# EAGLE design atmega embedded main (EAGLE 9.5.1)
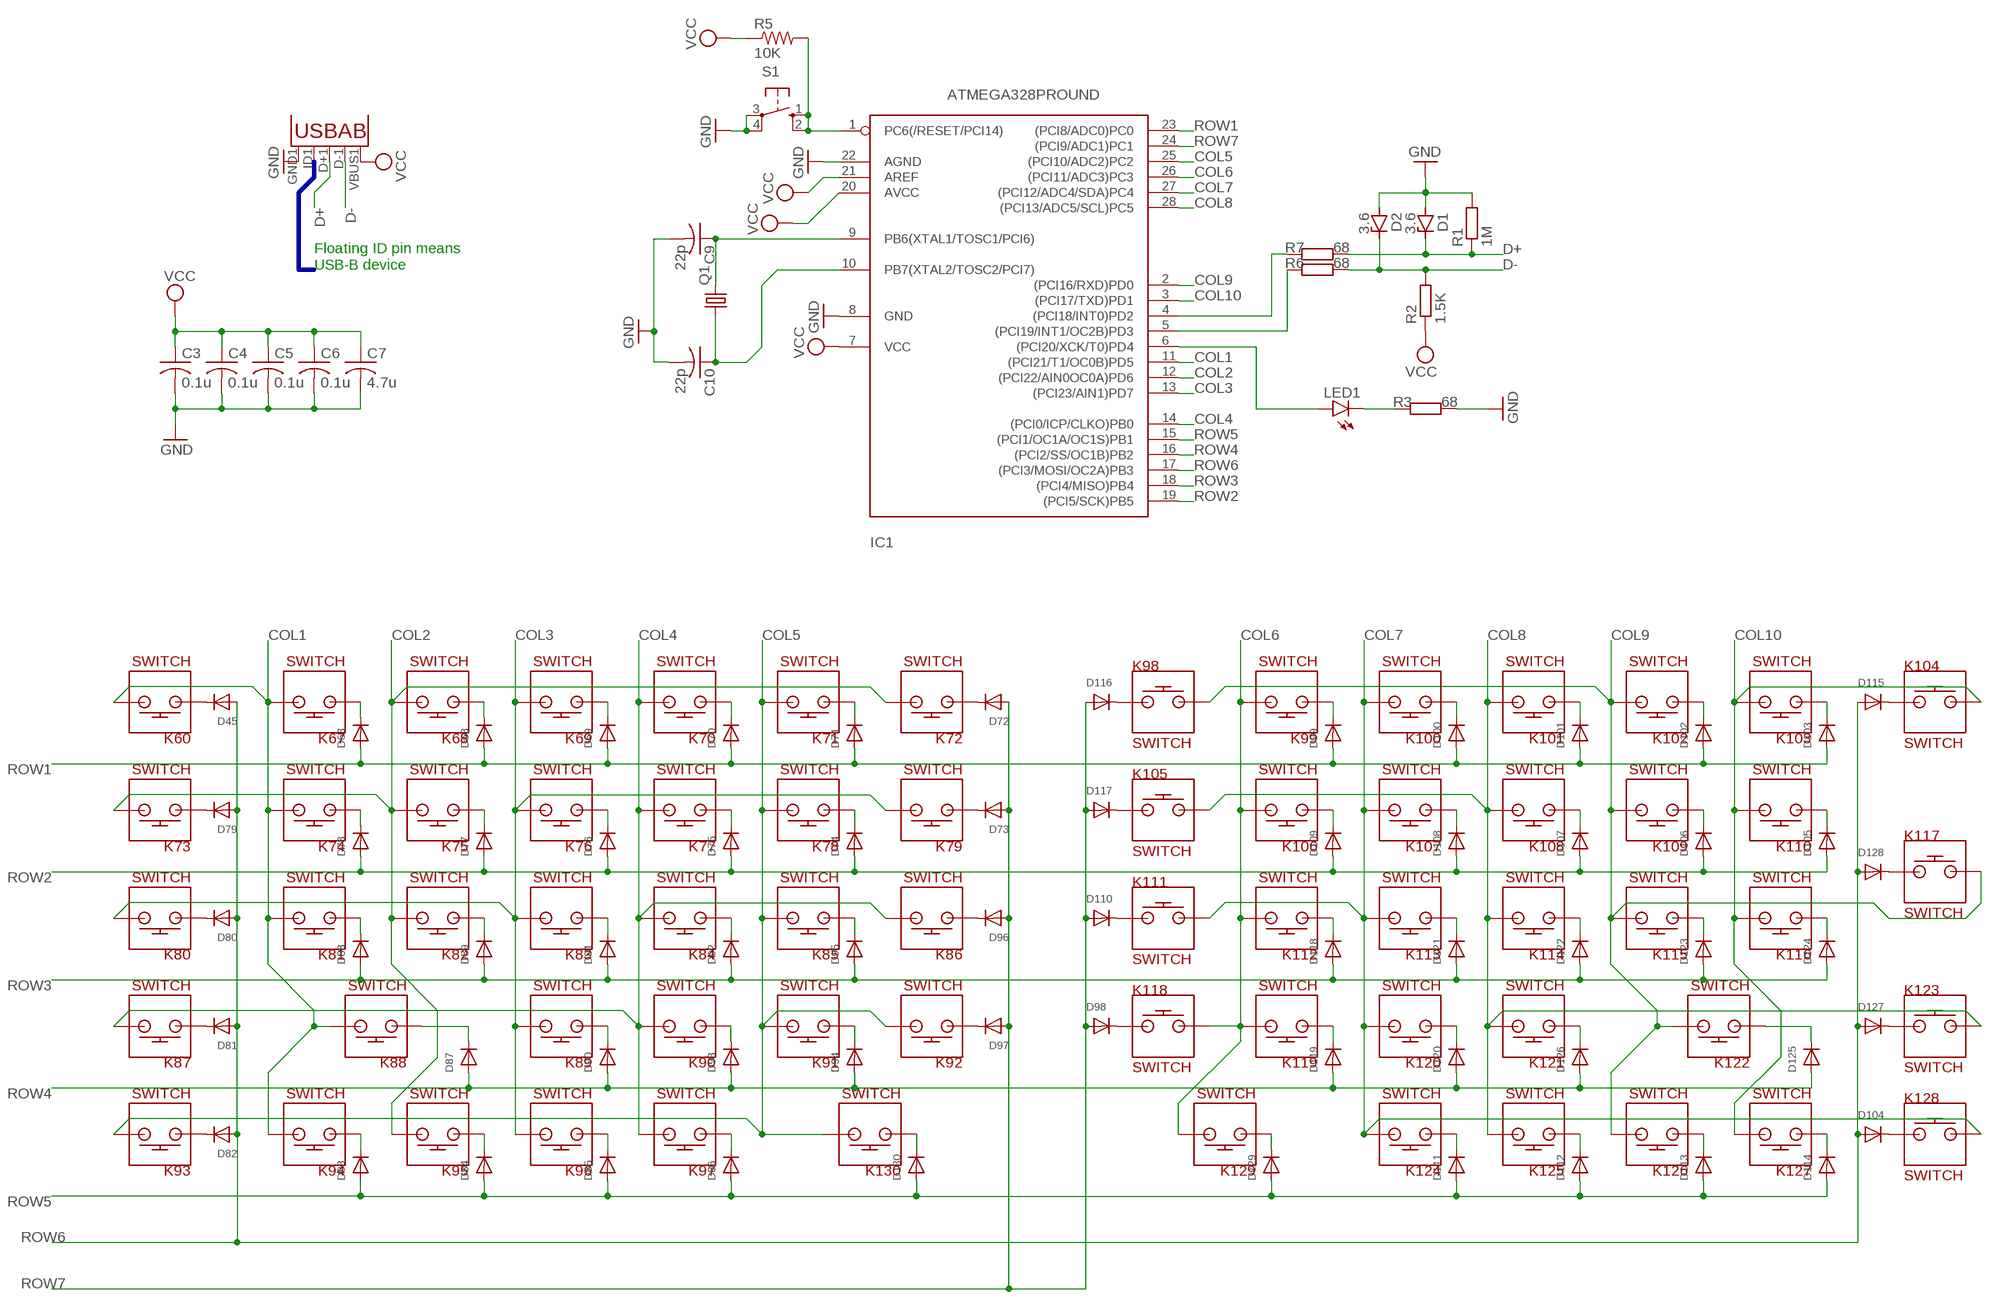
[diagram p0: schematic, sheet 1]

## Parts
C3  0.1u  C-USC0805  [C0805]
C4  0.1u  C-USC0805  [C0805]
C5  0.1u  C-USC0805  [C0805]
C6  0.1u  C-USC0805  [C0805]
C7  4.7u  C-USC0805  [C0805]
C9  22p  C-USC0805  [C0805]
C10  22p  C-USC0805  [C0805]
D1  3.6  ZENER-DIODESMB  [SMB]
D2  3.6  ZENER-DIODESMB  [SMB]
D45  DIODESMA  [SMADIODE]
D63  DIODESMA  [SMADIODE]
D68  DIODESMA  [SMADIODE]
D69  DIODESMA  [SMADIODE]
D70  DIODESMA  [SMADIODE]
D71  DIODESMA  [SMADIODE]
D72  DIODESMA  [SMADIODE]
D73  DIODESMA  [SMADIODE]
D74  DIODESMA  [SMADIODE]
D75  DIODESMA  [SMADIODE]
D76  DIODESMA  [SMADIODE]
D77  DIODESMA  [SMADIODE]
D78  DIODESMA  [SMADIODE]
D79  DIODESMA  [SMADIODE]
D80  DIODESMA  [SMADIODE]
D81  DIODESMA  [SMADIODE]
D82  DIODESMA  [SMADIODE]
D83  DIODESMA  [SMADIODE]
D84  DIODESMA  [SMADIODE]
D85  DIODESMA  [SMADIODE]
D86  DIODESMA  [SMADIODE]
D87  DIODESMA  [SMADIODE]
D88  DIODESMA  [SMADIODE]
D89  DIODESMA  [SMADIODE]
D90  DIODESMA  [SMADIODE]
D91  DIODESMA  [SMADIODE]
D92  DIODESMA  [SMADIODE]
D93  DIODESMA  [SMADIODE]
D94  DIODESMA  [SMADIODE]
D95  DIODESMA  [SMADIODE]
D96  DIODESMA  [SMADIODE]
D97  DIODESMA  [SMADIODE]
D98  DIODESMA  [SMADIODE]
D99  DIODESMA  [SMADIODE]
D100  DIODESMA  [SMADIODE]
D101  DIODESMA  [SMADIODE]
D102  DIODESMA  [SMADIODE]
D103  DIODESMA  [SMADIODE]
D104  DIODESMA  [SMADIODE]
D105  DIODESMA  [SMADIODE]
D106  DIODESMA  [SMADIODE]
D107  DIODESMA  [SMADIODE]
D108  DIODESMA  [SMADIODE]
D109  DIODESMA  [SMADIODE]
D110  DIODESMA  [SMADIODE]
D111  DIODESMA  [SMADIODE]
D112  DIODESMA  [SMADIODE]
D113  DIODESMA  [SMADIODE]
D114  DIODESMA  [SMADIODE]
D115  DIODESMA  [SMADIODE]
D116  DIODESMA  [SMADIODE]
D117  DIODESMA  [SMADIODE]
D118  DIODESMA  [SMADIODE]
D119  DIODESMA  [SMADIODE]
D120  DIODESMA  [SMADIODE]
D121  DIODESMA  [SMADIODE]
D122  DIODESMA  [SMADIODE]
D123  DIODESMA  [SMADIODE]
D124  DIODESMA  [SMADIODE]
D125  DIODESMA  [SMADIODE]
D126  DIODESMA  [SMADIODE]
D127  DIODESMA  [SMADIODE]
D128  DIODESMA  [SMADIODE]
D129  DIODESMA  [SMADIODE]
D130  DIODESMA  [SMADIODE]
IC1  ATMEGA328PROUND  [DIL28-3-ROUND]
K60  SWITCH  [KAILH_LOW_PROFILE]
K67  SWITCH  [KAILH_LOW_PROFILE]
K68  SWITCH  [KAILH_LOW_PROFILE]
K69  SWITCH  [KAILH_LOW_PROFILE]
K70  SWITCH  [KAILH_LOW_PROFILE]
K71  SWITCH  [KAILH_LOW_PROFILE]
K72  SWITCH  [KAILH_LOW_PROFILE]
K73  SWITCH  [KAILH_LOW_PROFILE]
K74  SWITCH  [KAILH_LOW_PROFILE]
K75  SWITCH  [KAILH_LOW_PROFILE]
K76  SWITCH  [KAILH_LOW_PROFILE]
K77  SWITCH  [KAILH_LOW_PROFILE]
K78  SWITCH  [KAILH_LOW_PROFILE]
K79  SWITCH  [KAILH_LOW_PROFILE]
K80  SWITCH  [KAILH_LOW_PROFILE]
K81  SWITCH  [KAILH_LOW_PROFILE]
K82  SWITCH  [KAILH_LOW_PROFILE]
K83  SWITCH  [KAILH_LOW_PROFILE]
K84  SWITCH  [KAILH_LOW_PROFILE]
K85  SWITCH  [KAILH_LOW_PROFILE]
K86  SWITCH  [KAILH_LOW_PROFILE]
K87  SWITCH  [KAILH_LOW_PROFILE]
K88  SWITCH  [KAILH_LOW_PROFILE]
K89  SWITCH  [KAILH_LOW_PROFILE]
K90  SWITCH  [KAILH_LOW_PROFILE]
K91  SWITCH  [KAILH_LOW_PROFILE]
K92  SWITCH  [KAILH_LOW_PROFILE]
K93  SWITCH  [KAILH_LOW_PROFILE]
K94  SWITCH  [KAILH_LOW_PROFILE]
K95  SWITCH  [KAILH_LOW_PROFILE]
K96  SWITCH  [KAILH_LOW_PROFILE]
K97  SWITCH  [KAILH_LOW_PROFILE]
K98  SWITCH  [KAILH_LOW_PROFILE]
K99  SWITCH  [KAILH_LOW_PROFILE]
K100  SWITCH  [KAILH_LOW_PROFILE]
K101  SWITCH  [KAILH_LOW_PROFILE]
K102  SWITCH  [KAILH_LOW_PROFILE]
K103  SWITCH  [KAILH_LOW_PROFILE]
K104  SWITCH  [KAILH_LOW_PROFILE]
K105  SWITCH  [KAILH_LOW_PROFILE]
K106  SWITCH  [KAILH_LOW_PROFILE]
K107  SWITCH  [KAILH_LOW_PROFILE]
K108  SWITCH  [KAILH_LOW_PROFILE]
K109  SWITCH  [KAILH_LOW_PROFILE]
K110  SWITCH  [KAILH_LOW_PROFILE]
K111  SWITCH  [KAILH_LOW_PROFILE]
K112  SWITCH  [KAILH_LOW_PROFILE]
K113  SWITCH  [KAILH_LOW_PROFILE]
K114  SWITCH  [KAILH_LOW_PROFILE]
K115  SWITCH  [KAILH_LOW_PROFILE]
K116  SWITCH  [KAILH_LOW_PROFILE]
K117  SWITCH  [KAILH_LOW_PROFILE]
K118  SWITCH  [KAILH_LOW_PROFILE]
K119  SWITCH  [KAILH_LOW_PROFILE]
K120  SWITCH  [KAILH_LOW_PROFILE]
K121  SWITCH  [KAILH_LOW_PROFILE]
K122  SWITCH  [KAILH_LOW_PROFILE]
K123  SWITCH  [KAILH_LOW_PROFILE]
K124  SWITCH  [KAILH_LOW_PROFILE]
K125  SWITCH  [KAILH_LOW_PROFILE]
K126  SWITCH  [KAILH_LOW_PROFILE]
K127  SWITCH  [KAILH_LOW_PROFILE]
K128  SWITCH  [KAILH_LOW_PROFILE]
K129  SWITCH  [KAILH_LOW_PROFILE]
K130  SWITCH  [KAILH_LOW_PROFILE]
LED1  LEDCHIPLED_1206  [CHIPLED_1206]
Q1  CRYSTALHC49S  [HC49/S]
R1  1M  RR1206  [R1206]
R2  1.5K  RR1206  [R1206]
R3  68  RR1206  [R1206]
R5  10K  R-US_M0805  [M0805]
R6  68  RR1206  [R1206]
R7  68  RR1206  [R1206]
S1  10-XX  [B3F-10XX]
U1  USB""  [USB-MICRO-SMD]

## Nets
COL1: IC1.11((PCI21/T1/OC0B)PD5) K60.P$2 K67.P$2 K74.P$2 K81.P$2 K88.P$2 K94.P$2
COL2: IC1.12((PCI22/AIN0OC0A)PD6) K68.P$2 K72.P$2 K73.P$2 K75.P$2 K82.P$2 K95.P$2
COL3: IC1.13((PCI23/AIN1)PD7) K69.P$2 K76.P$2 K79.P$2 K80.P$2 K83.P$2 K89.P$2 K96.P$2
COL4: IC1.14((PCI0/ICP/CLKO)PB0) K70.P$2 K77.P$2 K84.P$2 K86.P$2 K87.P$2 K90.P$2 K97.P$2
COL5: IC1.25((PCI10/ADC2)PC2) K71.P$2 K78.P$2 K85.P$2 K91.P$2 K92.P$2 K93.P$2 K130.P$2
COL6: IC1.26((PCI11/ADC3)PC3) K99.P$2 K106.P$2 K112.P$2 K118.P$2 K119.P$2 K129.P$2
COL7: IC1.27((PCI12/ADC4/SDA)PC4) K100.P$2 K107.P$2 K111.P$2 K113.P$2 K120.P$2 K124.P$2 K128.P$2
COL8: IC1.28((PCI13/ADC5/SCL)PC5) K101.P$2 K105.P$2 K108.P$2 K114.P$2 K121.P$2 K123.P$2 K125.P$2
COL9: IC1.2((PCI16/RXD)PD0) K98.P$2 K102.P$2 K109.P$2 K115.P$2 K117.P$2 K122.P$2 K126.P$2
COL10: IC1.3((PCI17/TXD)PD1) K103.P$2 K104.P$2 K110.P$2 K116.P$2 K127.P$2
D+: D1.C R1.1 R7.2 U1.D+1(D+)
D-: D2.C R2.2 R6.2 U1.D-1(D-)
GND: C3.2 C4.2 C5.2 C6.2 C7.2 C9.2 C10.2 D1.A D2.A IC1.8(GND) IC1.22(AGND) R1.2 R3.2 S1.3(P) S1.4(P1) U1.GND1(GND)
N$1: D45.C K60.P$1
N$2: D79.C K73.P$1
N$3: D80.C K80.P$1
N$4: D81.C K87.P$1
N$5: D82.C K93.P$1
N$6: D63.C K67.P$1
N$7: D88.C K81.P$1
N$8: D78.C K74.P$1
N$9: D83.C K94.P$1
N$10: D77.C K75.P$1
N$11: D89.C K82.P$1
N$12: D68.C K68.P$1
N$13: D84.C K95.P$1
N$14: D76.C K76.P$1
N$15: IC1.1(PC6(/RESET/PCI14)) R5.2 S1.1(S) S1.2(S1)
N$16: C9.1 IC1.9(PB6(XTAL1/TOSC1/PCI6)) Q1.2
N$17: C10.1 IC1.10(PB7(XTAL2/TOSC2/PCI7)) Q1.1
N$18: D69.C K69.P$1
N$19: D90.C K89.P$1
N$20: D85.C K96.P$1
N$21: IC1.4((PCI18/INT0)PD2) R7.1
N$22: D91.C K83.P$1
N$23: D86.C K97.P$1
N$24: D70.C K70.P$1
N$25: D75.C K77.P$1
N$26: D129.C K129.P$1
N$27: D116.C K98.P$1
N$28: D117.C K105.P$1
N$29: D92.C K84.P$1
N$30: D93.C K90.P$1
N$31: D94.C K91.P$1
N$32: D71.C K71.P$1
N$33: D74.C K78.P$1
N$34: D95.C K85.P$1
N$35: D130.C K130.P$1
N$36: D72.C K72.P$1
N$37: D73.C K79.P$1
N$38: D96.C K86.P$1
N$39: D97.C K92.P$1
N$40: D110.C K111.P$1
N$41: D98.C K118.P$1
N$42: D115.C K104.P$1
N$43: D119.C K119.P$1
N$44: D99.C K99.P$1
N$45: D109.C K106.P$1
N$46: D118.C K112.P$1
N$47: D111.C K124.P$1
N$48: D100.C K100.P$1
N$49: D108.C K107.P$1
N$50: D121.C K113.P$1
N$51: D120.C K120.P$1
N$52: D126.C K121.P$1
N$53: D101.C K101.P$1
N$54: D107.C K108.P$1
N$55: D122.C K114.P$1
N$56: D112.C K125.P$1
N$57: D123.C K115.P$1
N$58: D106.C K109.P$1
N$59: D102.C K102.P$1
N$60: D113.C K126.P$1
N$61: D124.C K116.P$1
N$62: D105.C K110.P$1
N$63: D103.C K103.P$1
N$64: D114.C K127.P$1
N$65: D128.C K117.P$1
N$66: D127.C K123.P$1
N$67: D104.C K128.P$1
N$68: IC1.5((PCI19/INT1/OC2B)PD3) R6.1
N$69: IC1.6((PCI20/XCK/T0)PD4) LED1.A
N$70: LED1.C R3.1
N$80: D87.C K88.P$1
N$142: D125.C K122.P$1
ROW1: D63.A D68.A D69.A D70.A D71.A D99.A D100.A D101.A D102.A D103.A IC1.23((PCI8/ADC0)PC0)
ROW2: D74.A D75.A D76.A D77.A D78.A D105.A D106.A D107.A D108.A D109.A IC1.19((PCI5/SCK)PB5)
ROW3: D88.A D89.A D91.A D92.A D95.A D118.A D121.A D122.A D123.A D124.A IC1.18((PCI4/MISO)PB4)
ROW4: D87.A D90.A D93.A D94.A D119.A D120.A D125.A D126.A IC1.16((PCI2/SS/OC1B)PB2)
ROW5: D83.A D84.A D85.A D86.A D111.A D112.A D113.A D114.A D129.A D130.A IC1.15((PCI1/OC1A/OC1S)PB1)
ROW6: D45.A D79.A D80.A D81.A D82.A D104.A D115.A D127.A D128.A IC1.17((PCI3/MOSI/OC2A)PB3)
ROW7: D72.A D73.A D96.A D97.A D98.A D110.A D116.A D117.A IC1.24((PCI9/ADC1)PC1)
VCC: C3.1 C4.1 C5.1 C6.1 C7.1 IC1.7(VCC) IC1.20(AVCC) IC1.21(AREF) R2.1 R5.1 U1.VBUS1(VBUS)
Unconnected: U1.ID1(USBID)

## Buses
B$1

## Notes on the sheet
- Floating ID pin means
  USB-B device

## Library data of the parts
C3-C7 C9 C10 = adafruit:C-US: CAPACITOR, American symbol
D1 D2 = diode:ZENER-DIODE: Z-Diode
D45 D63 D68-D130 = adafruit:DIODE: Diode SMADIODE - SMA Surface Mount Package 20V 1A Schottky Diode Digikey: 641-1014-6-ND DO-1N4148 - Through Hole Small Current Diode SOD-123 20V 1 A (.5mV Vf) Schottky Diode - Digikey: MBRX120TPMSCT-ND SOD-323 10V 570mA (.38mV Vf, 3ns) Schottky Diode - Digikey: ZLLS410CT-ND SOD-523 30V 30mA Schottky Diode (RB751S-40TE61) - Digikey: RB751S-40TE61CT-ND SOT23-R/W - SOT23 Package (R = Solder Paste/Reflow Ovens, W = Hand-Soldering) BAT54Film 40V 300mA - Digikey: 497-7162-1-ND
IC1 = atmega328:ATMEGA328*P: MICROCONTROLLER 32 kBytes FLASH 2 kBytes SRAM 1 kBytes EEPROM USART 8-channel 10 bit ADC
K60 K67-K130 = keyboard_switch:SWITCH
LED1 = led:LED: LED OSRAM: - CHIPLED LG R971, LG N971, LY N971, LG Q971, LY Q971, LO R971, LY R971 LH N974, LH R974 LS Q976, LO Q976, LY Q976 LO Q996 - Hyper CHIPLED LW Q18S LB Q993, LB Q99A, LB R99A - SideLED LS A670, LO A670, LY A670, LG A670, LP A670 LB A673, LV A673, LT A673, LW A673 LH A674 LY A675 LS A676, LA A676, LO A676, LY A676, LW A676 LS A679, LY A679, LG A679 - Hyper Micro SIDELED® LS Y876, LA Y876, LO Y876, LY Y876 LT Y87S - SmartLED LW L88C, LW L88S LB L89C, LB L89S, LG L890 LS L89K, LO L89K, LY L89K LS L896, LA L896, LO L896, LY L896 - TOPLED LS T670, LO T670, LY T670, LG T670, LP T670 LSG T670, LSP T670, LSY T670, LOP T670, LYG T670 LG T671, LOG T671, LSG T671 LB T673, LV T673, LT T673, LW T673 LH T674 LS T676, LA T676, LO T676, LY T676, LB T676, LH T676, LSB T676, LW T676 LB T67C, LV T67C, LT T67C, LS T67K, LO T67K, LY T67K, LW E67C LS E67B, LA E67B, LO E67B, LY E67B, LB E67C, LV E67C, LT E67C LW T67C LS T679, LY T679, LG T679 LS T770, LO T770, LY T770, LG T770, LP T770 LB T773, LV T773, LT T773, LW T773 LH T774 LS E675, LA E675, LY E675, LS T675 LS T776, LA T776, LO T776, LY T776, LB T776 LHGB T686 LT T68C, LB T68C - Hyper Mini TOPLED® LB M676 - Mini TOPLED Santana® LG M470 LS M47K, LO M47K, LY M47K Source: http://www.osram.convergy.de LUXEON: - LUMILED® LXK2-PW12-R00, LXK2-PW12-S00, LXK2-PW14-U00, LXK2-PW14-V00 LXK2-PM12-R00, LXK2-PM12-S00, LXK2-PM14-U00 LXK2-PE12-Q00, LXK2-PE12-R00, LXK2-PE12-S00, LXK2-PE14-T00, LXK2-PE14-U00 LXK2-PB12-K00, LXK2-PB12-L00, LXK2-PB12-M00, LXK2-PB14-N00, LXK2-PB14-P00, LXK2-PB14-Q00 LXK2-PR12-L00, LXK2-PR12-M00, LXK2-PR14-Q00, LXK2-PR14-R00 LXK2-PD12-Q00, LXK2-PD12-R00, LXK2-PD12-S00 LXK2-PH12-R00, LXK2-PH12-S00 LXK2-PL12-P00, LXK2-PL12-Q00, LXK2-PL12-R00 Source: www.luxeon.com KINGBRIGHT: KA-3528ASYC Source: www.kingbright.com
Q1 = crystal:CRYSTAL: CRYSTAL; OC_FARNELL: 1667008; OC_NEWARK: unknown
R1-R3 R6 R7 = eagle-ltspice:R: RESISTOR, European symbol; SPICEMODEL: NONE; SPICEPREFIX: R
R5 = adafruit:R-US_: RESISTOR, American symbol
S1 = switch-omron:10-XX: OMRON SWITCH; MPN: B3F-1000; OC_FARNELL: 176432; OC_NEWARK: 36M3542
U1 = microusb:USB: This is a USB AB connector that is compatible with USB OTG. i.e. this connector can serve as a host or device

## Net classes
0 default: width 2 mm, drill 2 mm

## Board
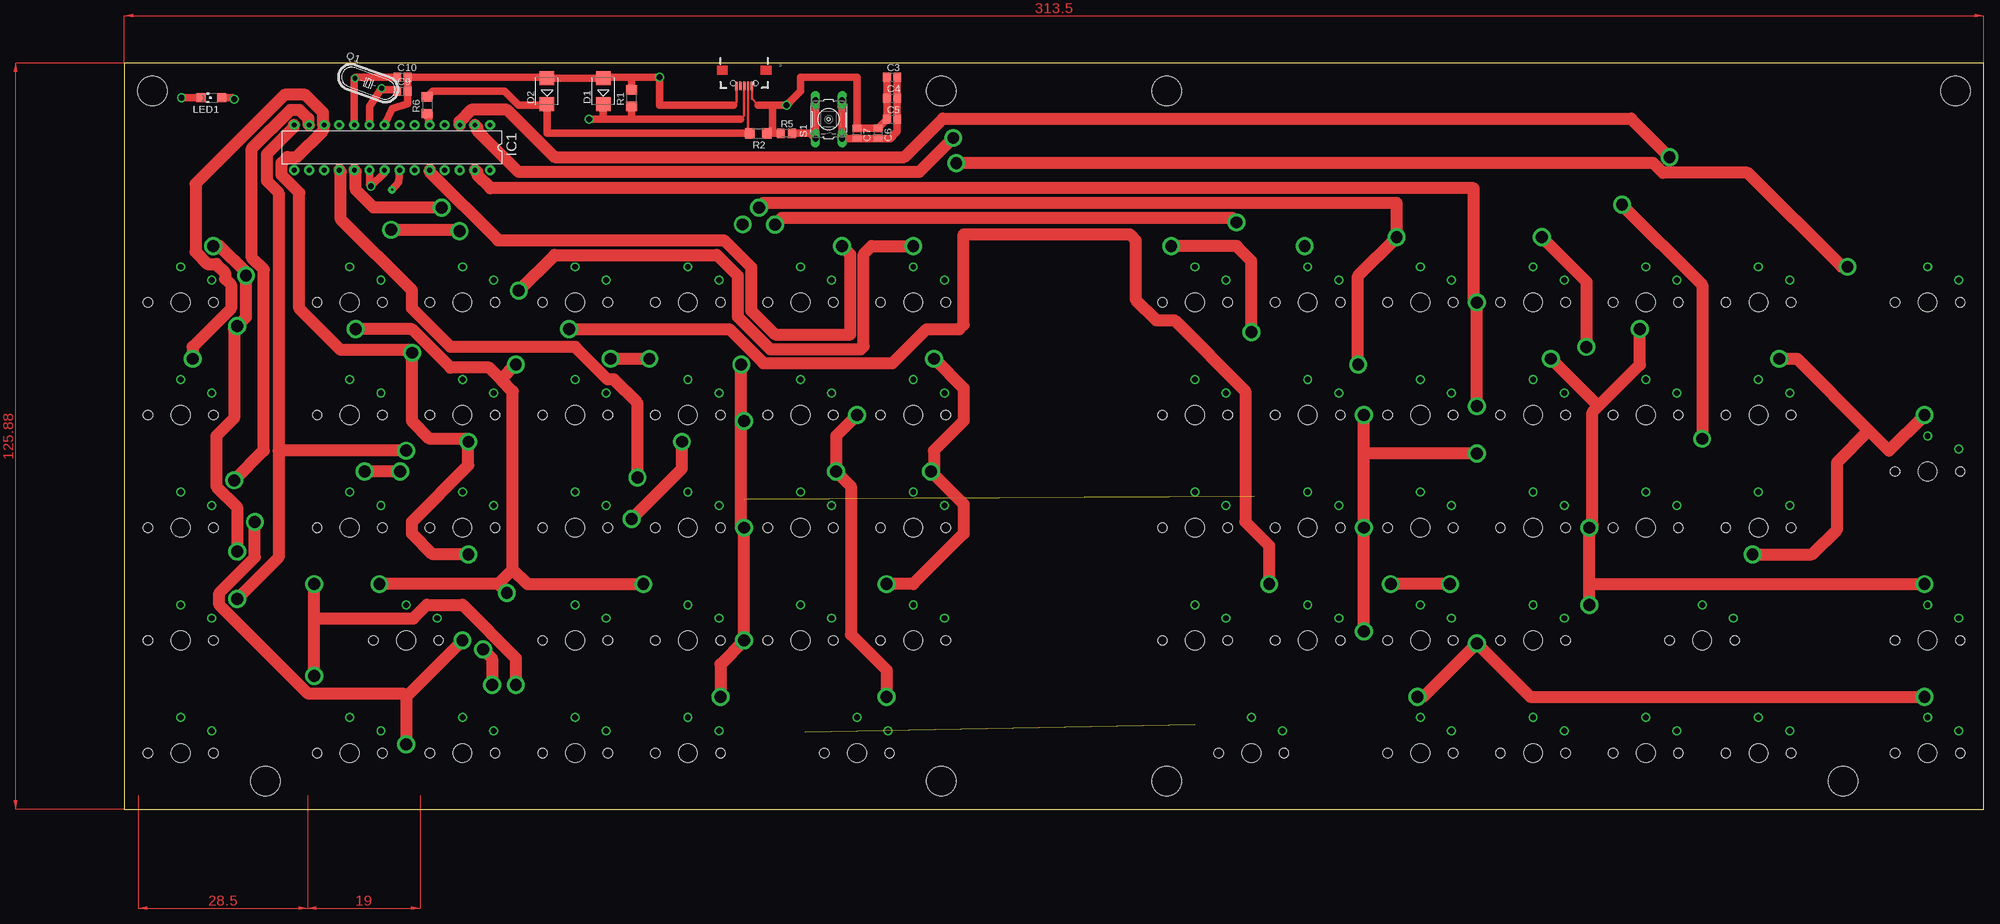
[diagram p1: board, top side]
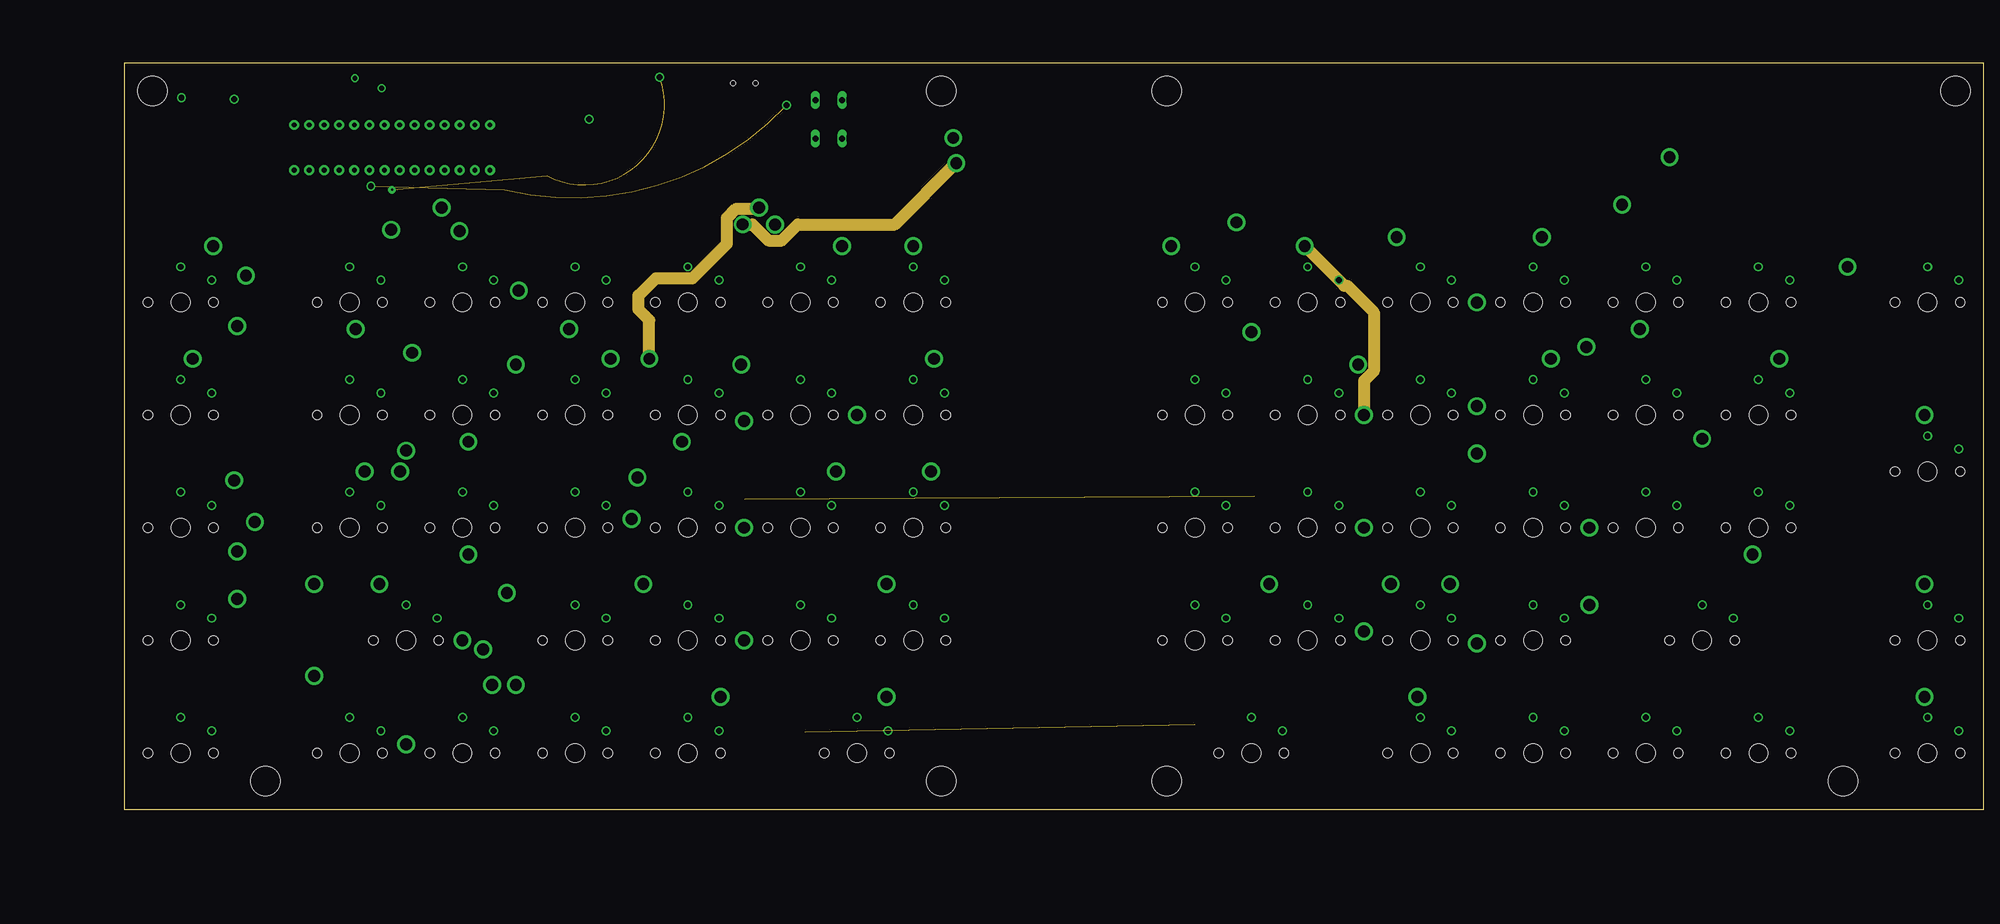
[diagram p2: board, inner layer Route7]
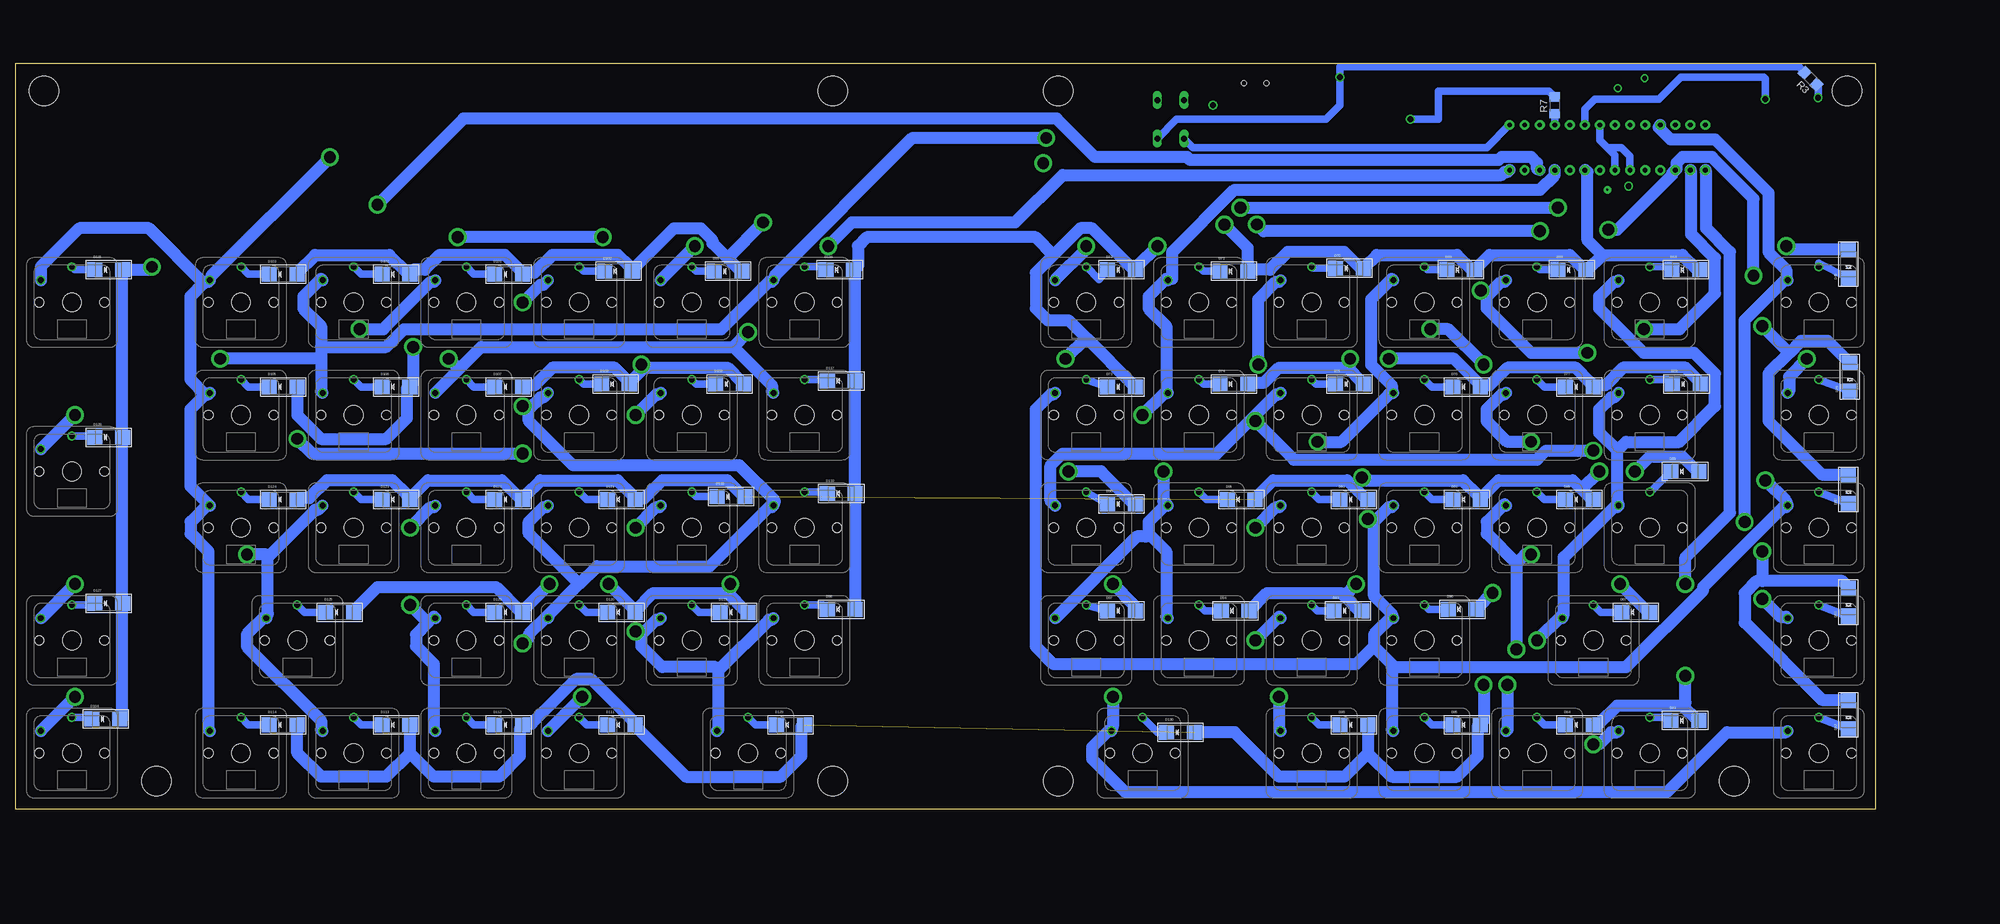
[diagram p3: board, bottom side, seen from below]

Size 313.5 x 125.88 mm. Coordinates in mm from the lower left corner, seen from the top.
Outline: 0,0 313.5,0 313.5,125.88 0,125.88 0,0
Copper layers (1*16): Top 0.035mm / dielectric 1.5mm / Bottom 0.035mm
Design rules "default": minimum track width 6mil, minimum drill 0.35mm, track to track 6mil, track to pad 6mil, pad to pad 6mil, via to via 6mil, smd to smd 6mil, copper to edge 40mil, drill to drill 6mil, minimum pad ring 10mil, minimum via ring 8mil, stop-mask expansion 4mil, vias tented up to drill 0mil, thermal gap 10mil
Holes 5 mm at 23.75,4.75 289.75,4.75 137.75,4.75 175.75,4.75 137.75,121.12 4.75,121.12 175.75,121.12 308.75,121.12
tRestrict: area 142.5,-0.5 to 169.5,95.5; area 137.5,118.5 to 176.5,125.5
bRestrict: area 137.5,118.5 to 176.5,125.5; area 142.5,-0.5 to 169.5,95.5
vRestrict: area 142.5,95.5 to 169.5,118.5; area 26.5,106.5 to 63.5,116.5; area 8.8,121.2 to 12.8,125.2; area 11.5,118.2 to 17.5,121.2; area 69.5,118.5 to 73.5,123.5; area 78.5,118.5 to 82.5,123.5; area 84.5,118.5 to 86.5,121.5; area 99.5,121.5 to 109.5,125.5; area 104.5,113.5 to 113.5,114.5; area 115.5,111.5 to 121.5,120.5; area 122.5,112.5 to 127.5,115.5; area 128.5,115.5 to 130.5,124.5

### Footprints (pad centres in the part's own frame; a part is rotated, then mirrored left to right if it is on the bottom)
C0805 = smd 1.3 x 1.5: 1 -0.85,0; 2 0.85,0
SMB = smd 2.4 x 2.4: A 2.2,0; C -2.2,0
SMADIODE = smd 2.54 x 2.54: A 2.349,0; C -2.349,0
DIL28-3-ROUND = drill 0.813 pad 1.676: 1 -16.51,-3.81; 2 -13.97,-3.81; 3 -11.43,-3.81; 4 -8.89,-3.81; 5 -6.35,-3.81; 6 -3.81,-3.81; 7 -1.27,-3.81; 8 1.27,-3.81; 9 3.81,-3.81; 10 6.35,-3.81; 11 8.89,-3.81; 12 11.43,-3.81; 13 13.97,-3.81; 14 16.51,-3.81; 15 16.51,3.81; 16 13.97,3.81; 17 11.43,3.81; 18 8.89,3.81; 19 6.35,3.81; 20 3.81,3.81; 21 1.27,3.81; 22 -1.27,3.81; 23 -3.81,3.81; 24 -6.35,3.81; 25 -8.89,3.81; 26 -11.43,3.81; 27 -13.97,3.81; 28 -16.51,3.81
KAILH_LOW_PROFILE = drill 1: P$1 0,6; P$2 -5.25,3.75 | hole 1.6: -5.5,0; 5.5,0 | hole 3.2: 0,0
CHIPLED_1206 = smd 1.5 x 1.5: A 0,-1.75; C 0,1.75
HC49/S = drill 0.813: 1 -2.413,0; 2 2.413,0
R1206 = smd 1.6 x 1.803: 1 -1.422,0; 2 1.422,0
M0805 = smd 1.3 x 1.6: 1 -0.95,0; 2 0.95,0
B3F-10XX = drill 1.016 long: 1 -3.251,2.261; 2 3.251,2.261; 3 -3.251,-2.261; 4 3.251,-2.261
USB-MICRO-SMD = smd 1.4 x 0.4: D+1 2.7,0; D-1 2.7,0.65; GND1 2.7,-1.3; ID1 2.7,-0.65; VBUS1 2.7,1.3 | hole 0.85: 2.2,1.9; 2.2,-1.9

### Placement (x,y rotation side)
C3  129.44,123.5 0 top
C4  129.44,119.94 0 top
C5  129.44,116.38 0 top
C6  127.06,114 270 top
C7  123.5,114 270 top
C9  46.91,121.12 0 top
C10  46.91,123.5 0 top
D1  80.75,121.12 90 top
D2  71.25,121.12 90 top
D45  4.5,91.94 90 bottom
D63  31.94,91 0 bottom
D68  51.12,91 0 bottom
D69  69.88,91 0 bottom
D70  88.62,91.25 0 bottom
D71  108.12,90.75 0 bottom
D72  127.06,91 0 bottom
D73  127.06,71.25 0 bottom
D74  108.12,71.75 0 bottom
D75  88.62,71.75 0 bottom
D76  68.88,71.25 0 bottom
D77  49.88,71.25 0 bottom
D78  31.81,71.75 0 bottom
D79  4.25,72.94 90 bottom
D80  4.5,53.94 90 bottom
D81  4.5,34.94 90 bottom
D82  4.5,15.94 90 bottom
D83  32.06,15 0 bottom
D84  49.88,14.25 0 bottom
D85  68.88,14.25 0 bottom
D86  87.88,14.25 0 bottom
D87  40.38,33.25 0 bottom
D88  32.06,57 0 bottom
D89  49.88,52.25 0 bottom
D90  69.62,33.75 0 bottom
D91  68.88,52.25 0 bottom
D92  87.88,52.25 0 bottom
D93  88.88,33.5 0 bottom
D94  107.88,33.5 0 bottom
D95  106.88,52.25 0 bottom
D96  127.06,51.5 0 bottom
D97  127.06,33.5 0 bottom
D98  174.31,33.75 0 bottom
D99  193.38,90.75 0 bottom
D100  211.88,90.75 0 bottom
D101  230.38,90.25 0 bottom
D102  249.38,90.25 0 bottom
D103  268.38,90.25 0 bottom
D104  298.31,15.25 0 bottom
D105  268.38,71.25 0 bottom
D106  249.38,71.25 0 bottom
D107  230.38,71.25 0 bottom
D108  212.38,71.75 0 bottom
D109  193.12,71.75 0 bottom
D110  174.31,53.25 0 bottom
D111  211.38,14.25 0 bottom
D112  230.38,14.25 0 bottom
D113  249.38,14.25 0 bottom
D114  268.38,14.25 0 bottom
D115  297.81,91 0 bottom
D116  174.56,91 0 bottom
D117  174.31,72.25 0 bottom
D118  192.88,52.75 0 bottom
D119  192.38,33.25 0 bottom
D120  211.38,33.25 0 bottom
D121  211.38,52.25 0 bottom
D122  230.38,52.25 0 bottom
D123  249.38,52.25 0 bottom
D124  268.38,52.25 0 bottom
D125  258.88,33.25 0 bottom
D126  230.38,33.25 0 bottom
D127  297.81,34.75 0 bottom
D128  297.81,62.75 0 bottom
D129  182.88,14.25 0 bottom
D130  117.12,13 0 bottom
IC1  45.12,111.62 180 top
K60  9.5,85.5 0 bottom
K67  38,85.5 0 bottom
K68  57,85.5 0 bottom
K69  76,85.5 0 bottom
K70  95,85.5 0 bottom
K71  114,85.5 0 bottom
K72  133,85.5 0 bottom
K73  9.5,66.5 0 bottom
K74  38,66.5 0 bottom
K75  57,66.5 0 bottom
K76  76,66.5 0 bottom
K77  95,66.5 0 bottom
K78  114,66.5 0 bottom
K79  133,66.5 0 bottom
K80  9.5,47.5 0 bottom
K81  38,47.5 0 bottom
K82  57,47.5 0 bottom
K83  76,47.5 0 bottom
K84  95,47.5 0 bottom
K85  114,47.5 0 bottom
K86  133,47.5 0 bottom
K87  9.5,28.5 0 bottom
K88  47.5,28.5 0 bottom
K89  76,28.5 0 bottom
K90  95,28.5 0 bottom
K91  114,28.5 0 bottom
K92  133,28.5 0 bottom
K93  9.5,9.5 0 bottom
K94  38,9.5 0 bottom
K95  57,9.5 0 bottom
K96  76,9.5 0 bottom
K97  95,9.5 0 bottom
K98  180.5,85.5 0 bottom
K99  199.5,85.5 0 bottom
K100  218.5,85.5 0 bottom
K101  237.5,85.5 0 bottom
K102  256.5,85.5 0 bottom
K103  275.5,85.5 0 bottom
K104  304,85.5 0 bottom
K105  180.5,66.5 0 bottom
K106  199.5,66.5 0 bottom
K107  218.5,66.5 0 bottom
K108  237.5,66.5 0 bottom
K109  256.5,66.5 0 bottom
K110  275.5,66.5 0 bottom
K111  180.5,47.5 0 bottom
K112  199.5,47.5 0 bottom
K113  218.5,47.5 0 bottom
K114  237.5,47.5 0 bottom
K115  256.5,47.5 0 bottom
K116  275.5,47.5 0 bottom
K117  304,57 0 bottom
K118  180.5,28.5 0 bottom
K119  199.5,28.5 0 bottom
K120  218.5,28.5 0 bottom
K121  237.5,28.5 0 bottom
K122  266,28.5 0 bottom
K123  304,28.5 0 bottom
K124  218.5,9.5 0 bottom
K125  237.5,9.5 0 bottom
K126  256.5,9.5 0 bottom
K127  275.5,9.5 0 bottom
K128  304,9.5 0 bottom
K129  190,9.5 0 bottom
K130  123.5,9.5 0 bottom
LED1  14.69,120 90 top
Q1  41.12,122.47 340 top
R1  85.5,119.94 90 top
R2  106.88,114 180 top
R3  10.88,123.25 135 bottom
R5  111.62,114 0 top
R6  51.06,118.75 90 top
R7  54.03,118.75 90 bottom
S1  118.75,116.38 90 top
U1  104.5,124.69 270 top

### Tracks (layer width: path | path; a pad name or v marks a point on that pad's centre or on a via)
COL1  (via drill 2)
  Top 2: 47.5,19 v47.5,11 | v57,28.5 47.5,19 | v22,48.5 22,42.5 16,36.5 16,34.5 31,19.5 47,19.5 47.5,19
  Bottom 2: IC1.11 36.5,115 34.5,113 27,113 18,104 18,94 15,91 15,89.5 K60.P$2 15.5,89 22,82.5 v22,48.5 | v47.5,11 46.5,11 44.5,13 43.5,13 K94.P$2 | v57,28.5 53,32.5 K88.P$2 52.5,33 52.5,42.5 44,51 43.5,51 K81.P$2 43.5,52 43.5,60.5 | K74.P$2 44,69.5 44.5,69.5 46.5,67.5 46.5,63.5 43.5,60.5 | 43.5,60.5 42,62 33,62 27,68 27,73.5 30.5,77 39,77 46.5,84.5 46.5,86.5 44,89 43.5,89 K67.P$2
COL2  (via drill 2)
  Top 2: v11.5,76 11.5,78 18,84.5 18,88.5 17,89.5 17,90.5 15.5,92 14,92 12,94 12,105.5 27,120.5 30.5,120.5 33.5,117.5 33.5,115.5 IC1.12 33.5,114.5 29,110 27.5,110 26.5,109 26.5,107 29.5,104 29.5,84.5 36.5,77.5 48,77.5 v48.5,77 48.5,65.5 51.5,62.5 57.5,62.5 v58,62 58,58 48.5,48.5 48.5,46.5 52,43 v58,43 | v62,21 62,25.5 v60.5,27 | v133,95 126,95 124.62,93.62 124.62,78.12 124.13,77.63 108.87,77.63 103.4,83.1 103.4,90 99.9,93.5 72.5,93.5 v66.5,87.5
  Bottom 2: v11.5,76 14.5,73 14.5,70.5 K73.P$2 | v62,21 62,13.5 K95.P$2 | 60.5,41.5 v60.5,27 | 60.5,41.5 65.5,46.5 65.5,48.5 62.5,51.5 K82.P$2 | v58,62 62,62 65.5,65.5 65.5,67.5 63,70 62.5,70 K75.P$2 | v58,43 59,43 60.5,41.5 | 65.5,86.5 63,89 62.5,89 K68.P$2 | 65.5,86.5 65.5,84.5 58,77 v48.5,77 | K72.P$2 133,94.5 v133,95 | v66.5,87.5 65.5,86.5
COL3  (via drill 2)
  Top 2: v18.5,55.5 23.5,60.5 23.5,91 21.5,93 21.5,111.5 28,118 29.5,118 31,116.5 31,115.5 IC1.13 | v94,62 94,57.5 v85.5,49
  Bottom 2: K69.P$2 81.5,89.5 85,86 85,75 81.5,71.5 81.5,70.5 K76.P$2 82,70 90,62 v94,62 | 81.5,24 81.5,24.5 84.5,27.5 | 81.5,24 81.5,13.5 K96.P$2 | 84.5,27.5 84.5,29.5 81.5,32.5 K89.P$2 81.5,33 84.5,36 84.5,48.5 | 81.5,24 42,24 29,37 29,37.5 15.5,51 15,51 K80.P$2 15,52 v18.5,55.5 | 84.5,48.5 82,51 81.5,51 K83.P$2 | 84.5,27.5 87.5,24.5 138.5,24.5 141.5,27.5 141.5,67.5 139,70 138.5,70 K79.P$2 | v85.5,49 85,49 84.5,48.5
COL4  (via drill 2)
  Top 2: v19,35.5 26,42.5 26,60.5 | 26,60.5 26,104 24,106 24,110.5 28.5,115 IC1.14 | v100.5,19 100.5,24.5 v104.5,28.5 v104.5,47.5 104,48 104,65.5 | 104,65.5 v104,75 | v104.5,65.5 104,65.5 | v47.5,60.5 26,60.5
  Bottom 2: v19,35.5 16,32.5 15,32.5 K87.P$2 | 105,66 111,60 137,60 139,58 139,52 K86.P$2 | 105,66 101,70 100.5,70 K77.P$2 | v100.5,19 100.5,13.5 K97.P$2 | v104.5,28.5 100.5,32.5 K90.P$2 | v104.5,47.5 101,51 100.5,51 K84.P$2 | v104,75 104,86 101,89 100.5,89 K70.P$2 | 105,66 v104.5,65.5 98,59 57,59 55.5,60.5 v47.5,60.5
COL5  (via drill 2)
  Top 2: v123.5,66.5 120,63 v120,57 122.5,54.5 122.5,29.5 128.5,23.5 v128.5,19
  Bottom 2: K93.P$2 15,13 25,13 35,3 126.5,3 132,8.5 132,10.5 129,13.5 K130.P$2 128.5,14 v128.5,19 | 122.5,46.5 119.5,43.5 119.5,32.5 K91.P$2 | 122.5,46.5 122.5,48.5 119.5,51.5 | 119.5,51.5 K85.P$2 | K92.P$2 124.5,46 123,46 122.5,46.5 | IC1.25 54,107.5 54,107 56.5,104.5 108,104.5 118.5,94 118.5,89.5 K71.P$2 119.5,89.5 122.5,86.5 122.5,84.5 119.5,81.5 119.5,70.5 K78.P$2 120,70 v123.5,66.5 | v120,57 120,52 119.5,51.5
COL6  (via drill 2)
  Top 2: v209,30 v209,47.5 209,60 | 209,60 v209,66.5 | v228,60 209,60 | v266,62.5 266,88.5 v252.5,102
  Route7 2: v199,95 205.68,88.32 206.17,88.32 210.65,83.83 210.65,73.9 209,72.25 v209,66.5
  Bottom 2: 195,23.5 186.5,32 186,32 K118.P$2 | 195,23.5 195,13.5 K129.P$2 | 208,29.5 205.5,32 205,32 K119.P$2 | 208,29.5 208,27.5 204.5,24 195.5,24 195,23.5 | v209,47.5 205.5,51 205,51 K112.P$2 | v209,30 208.5,30 208,29.5 | v209,66.5 205.5,70 205,70 K106.P$2 | v199,95 K99.P$2 | IC1.26 57,108 57,109 58,110 63,110 63.5,109.5 115.5,109.5 116,110 131.5,110 138,116.5 238,116.5 v252.5,102 | v228,60 263.5,60 v266,62.5
COL7  (via drill 2)
  Top 2: v218,19 219,19 v228,28 237,19 v303.5,19 | v228,68 v228,85.5 227.5,86 227.5,104.75 61.75,104.75 59.5,107 59.5,107.5 IC1.27
  Bottom 2: v218,19 K124.P$2 | v228,28 227,29 227,29.5 224,32.5 K120.P$2 223.5,33 218.5,38 | 218.5,38 215.5,41 196.5,41 186.5,51 186,51 K111.P$2 185.5,52 191.5,58 219.5,58 227,65.5 227,67.5 | 218.5,38 227,46.5 227,48.5 224.5,51 224,51 K113.P$2 | K107.P$2 224.5,69.5 225,69.5 227,67.5 | K100.P$2 224.5,88.5 225,88.5 v228,85.5 | v228,68 227.5,68 227,67.5 | v303.5,19 K128.P$2
COL8  (via drill 2)
  Top 2: v247,34.5 247,38 | 247,38 v247,47.5 247.5,48 247.5,67 248.5,68 | v255.5,81 255.5,75 248.5,68 | 247,38 v303.5,38 | v176.5,95 187.5,95 190,92.5 v190,80.5 | v240.5,76 248.5,68
  Bottom 2: 244,31.5 243,32.5 K121.P$2 | 244,31.5 246,29.5 246,27.5 243,24.5 243,13.5 K125.P$2 | v247,47.5 243.5,51 243,51 K114.P$2 | 244,31.5 v247,34.5 | v255.5,81 251.5,81 243.5,89 243,89 K101.P$2 | v303.5,38 K123.P$2 | 192.5,78 186,71.5 186,70.5 K105.P$2 | 192.5,78 235,78 238.75,74.25 | K108.P$2 238.75,74.25 | v176.5,95 172.5,99 145,99 137,107 63,107 62.5,107.5 62,107.5 IC1.28 | 192.5,78 v190,80.5 | 238.75,74.25 v240.5,76
COL9  (via drill 2)
  Top 2: 294.12,63.88 288.75,58.5 288.75,47.25 284.5,43 v274.5,43 | v303.5,66.5 297.5,60.5 294.12,63.88 | v139.75,113.25 134,107.5 66.5,107.5 59.5,114.5 59.5,115 IC1.2 | 294.12,63.88 282,76 v279,76
  Bottom 2: K126.P$2 262,13.5 262,15 274.5,27.5 274.5,29.5 271.5,32.5 K122.P$2 271,33 271,42.5 | K115.P$2 262.5,50.5 263,50.5 271,42.5 | v303.5,66.5 K117.P$2 | v274.5,43 271.5,43 271,42.5 | 262,78 262,81.5 265,84.5 265,86.5 262,89.5 K102.P$2 | 262,78 262,76 | 262,76 262,70.5 K109.P$2 | 262,78 251,78 248,81 194.5,81 186.5,89 186,89 K98.P$2 185.5,90 162.25,113.25 v139.75,113.25 | 262,76 v279,76
COL10  (via drill 2)
  Top 2: IC1.3 56.5,115.5 56.5,116 58.5,118 64.5,118 72.5,110 131.5,110 138,116.5 254,116.5 v260.5,110
  Bottom 2: 281,51.5 284,48.5 284,46.5 281,43.5 281,13.5 K127.P$2 | 281,51.5 K116.P$2 | 281.5,70 281,70 K110.P$2 | 281.5,70 284,67.5 284,54.5 281,51.5 | 281.75,88.75 284,86.5 284,72.5 281.5,70 | 281.75,88.75 281.5,89 281,89 K103.P$2 280.5,90 v260.5,110 | K104.P$2 309.25,91.5 302.75,98 291,98 281.75,88.75
D+  (via drill 1)
  Top 0.406: U1.D+1 104.5,116.97 103.91,116.38
  Top 1.27: 103.91,116.38 85.5,116.38 | 85.5,116.38 80.75,116.38 | 80.75,116.38 v78.38,116.38 | R1.1 85.5,116.38 | D1.C 80.75,116.38
  Bottom 1.27: v78.38,116.38 73.62,116.38 73.62,121.12 54.98,121.12 R7.2
D-
  Top 0.406: U1.D-1 105.15,114.3 R2.2
  Top 1.27: R2.2 71.25,114 D2.C 71.08,118.75 66.5,118.75 64.12,121.12 52.02,121.12 R6.2
GND  (via drill 0.35 pad 1.3, 1)
  Top 0.406: U1.GND1 103.2,119.23 102.72,118.75
  Top 1.27: IC1.22 46.23,105.77 v45.12,104.5 | IC1.8 45.12,118.16 47.76,119.01 C9.2 C10.2 71.08,123.5 D2.A D1.A 80.92,123.5 85.5,123.5 | 102.72,118.75 90.25,118.75 v90.25,123.5 85.5,123.5 | 85.5,123.5 R1.2 | S1.4 S1.3 122.29,113.12 C7.2 C6.2 129.18,113.15 130.29,114.26 C5.2 C4.2 C3.2
  Route7 0.076: v45.12,104.5 71.25,106.88 arc138 v90.25,123.5
  Bottom 1.27: S1.3 117.76,116.38 92.62,116.38 90.25,118.75 v90.25,123.5 90.25,125.22 12.75,125.22 12.75,125.12 R3.2
N$1
  Bottom 1.27: K60.P$1 9.5,92.16 D45.C
N$2
  Bottom 1.27: D79.C 9.59,72.5 K73.P$1
N$3
  Bottom 1.27: D80.C 9.59,53.5 K80.P$1
N$4
  Bottom 1.27: D81.C 9.59,34.5 K87.P$1
N$5
  Bottom 1.27: D82.C 9.59,15.5 K93.P$1
N$6
  Bottom 1.27: D63.C 34.45,91.5 K67.P$1
N$7
  Bottom 1.27: D88.C 37.91,53.5 K81.P$1
N$8
  Bottom 1.27: D78.C 34.91,72.5 K74.P$1
N$9
  Bottom 1.27: D83.C 34.91,15.5 K94.P$1
N$10
  Bottom 1.27: D77.C 55.75,71.25 K75.P$1
N$11
  Bottom 1.27: D89.C 55.75,52.25 K82.P$1
N$12
  Bottom 1.27: D68.C 56.5,91 K68.P$1
N$13
  Bottom 1.27: D84.C 55.75,14.25 K95.P$1
N$14
  Bottom 1.27: D76.C 74.75,71.25 K76.P$1
N$15
  Top 1.27: R5.2 115.61,114 S1.1 S1.2
  Bottom 1.27: IC1.1 65.44,111.62 114.99,111.62 S1.1
N$16
  Top 1.27: IC1.9 41.31,118.62 Q1.2 43.52,121.38 45.81,121.38 C9.1
N$17
  Top 1.27: IC1.10 38.77,123.29 Q1.1 39.01,123.47 C10.1
N$18
  Bottom 1.27: D69.C 75.5,91 K69.P$1
N$19
  Bottom 1.27: D90.C 75.25,33.75 K89.P$1
N$20
  Bottom 1.27: D85.C 74.75,14.25 K96.P$1
N$21
  Bottom 1.27: IC1.4 R7.1
N$22
  Bottom 1.27: D91.C 74.75,52.25 K83.P$1
N$23
  Bottom 1.27: D86.C 93.75,14.25 K97.P$1
N$24
  Bottom 1.27: D70.C 94.75,91.25 K70.P$1
N$25
  Bottom 1.27: D75.C 94.25,71.75 K77.P$1
N$26
  Bottom 1.27: D129.C 188.75,14.25 K129.P$1
N$27
  Bottom 1.27: D116.C 177.41,91.5 K98.P$1
N$28
  Bottom 1.27: D117.C 176.91,72.5 K105.P$1
N$29
  Bottom 1.27: D92.C 93.75,52.25 K84.P$1
N$30
  Bottom 1.27: D93.C 94,33.5 K90.P$1
N$31
  Bottom 1.27: D94.C 113,33.5 K91.P$1
N$32
  Bottom 1.27: D71.C 113.25,90.75 K71.P$1
N$33
  Bottom 1.27: D74.C 113.25,71.75 K78.P$1
N$34
  Bottom 1.27: D95.C 112.75,52.25 K85.P$1
N$35
  Bottom 1.27: D130.C 121,13 K130.P$1
N$36
  Bottom 1.27: K72.P$1 130.84,89.34 D72.C
N$37
  Bottom 1.27: D73.C 133.09,72.5 K79.P$1
N$38
  Bottom 1.27: D96.C 133.09,53.5 K86.P$1
N$39
  Bottom 1.27: D97.C 133.09,34.5 K92.P$1
N$40
  Bottom 1.27: D110.C 176.91,53.5 K111.P$1
N$41
  Bottom 1.27: D98.C 177.41,34.5 K118.P$1
N$42
  Bottom 1.27: K104.P$1 303.5,91 D115.C
N$43
  Bottom 1.27: D119.C 198.25,33.25 K119.P$1
N$44
  Bottom 1.27: D99.C 198.75,90.75 K99.P$1
N$45
  Bottom 1.27: D109.C 198.75,71.75 K106.P$1
N$46
  Bottom 1.27: D118.C 198.75,52.75 K112.P$1
N$47
  Bottom 1.27: D111.C 217.25,14.25 K124.P$1
N$48
  Bottom 1.27: D100.C 217.75,90.75 K100.P$1
N$49
  Bottom 1.27: D108.C 217.75,71.75 K107.P$1
N$50
  Bottom 1.27: D121.C 217.25,52.25 K113.P$1
N$51
  Bottom 1.27: D120.C 217.25,33.25 K120.P$1
N$52
  Bottom 1.27: D126.C 236.25,33.25 K121.P$1
N$53
  Bottom 1.27: D101.C 236.25,90.25 K101.P$1
N$54
  Bottom 1.27: D107.C 236.25,71.25 K108.P$1
N$55
  Bottom 1.27: D122.C 236.25,52.25 K114.P$1
N$56
  Bottom 1.27: D112.C 236.25,14.25 K125.P$1
N$57
  Bottom 1.27: D123.C 255.25,52.25 K115.P$1
N$58
  Bottom 1.27: D106.C 255.25,71.25 K109.P$1
N$59
  Bottom 1.27: D102.C 255.25,90.25 K102.P$1
N$60
  Bottom 1.27: D113.C 255.25,14.25 K126.P$1
N$61
  Bottom 1.27: D124.C 274.25,52.25 K116.P$1
N$62
  Bottom 1.27: D105.C 274.25,71.25 K110.P$1
N$63
  Bottom 1.27: D103.C 274.25,90.25 K103.P$1
N$64
  Bottom 1.27: D114.C 274.25,14.25 K127.P$1
N$65
  Bottom 1.27: D128.C 300.41,63 K117.P$1
N$66
  Bottom 1.27: D127.C 300.41,34.5 K123.P$1
N$67
  Bottom 1.27: D104.C 300.91,15.5 K128.P$1
N$68
  Top 1.27: IC1.5 R6.1
N$69  (via drill 1)
  Top 1.27: LED1.A 18.25,120 v18.5,119.75
  Bottom 1.27: IC1.6 48.94,118.06 47.25,119.75 36.5,119.75 32.75,123.5 18.75,123.5 18.5,123.25 v18.5,119.75
N$70  (via drill 1)
  Top 1.27: LED1.C v9.62,120
  Bottom 1.27: R3.1 9.62,122 v9.62,120 | R3.1
N$80
  Bottom 1.27: D87.C 46.25,33.25 K88.P$1
N$142
  Bottom 1.27: D125.C 264.75,33.25 K122.P$1
ROW1  (via drill 2)
  Top 2: v187.5,99 186.75,99.75 110.85,99.75 v109.7,98.6
  Bottom 2: D103.A 266,90.5 263,93.5 250.5,93.5 247.5,90.5 D102.A 246.5,91 244.5,91 242,93.5 231,93.5 228.5,91 D101.A 228,90.5 226,90.5 223,93.5 212,93.5 210,91.5 D100.A 209.5,91 202.5,98 198,98 196,96 196,95.5 193.5,93 | 193.5,93 191.5,91 D99.A | 46,93.5 32.5,93.5 30,91 D63.A | 46,93.5 48.5,91 D68.A 49.5,91.5 51.5,93.5 65,93.5 67,91.5 D69.A 68,91 70.5,93.5 84,93.5 86,91.5 D70.A 87,91.5 89.5,94 99,94 102,91 105.5,91 D71.A 105.78,94.67 v109.7,98.6 | 46,93.5 48.5,96 48.5,107.5 IC1.23 | v187.5,99 193.5,93
ROW2  (via drill 2)
  Top 2: v82,76 v88.5,76 | v53.5,101.5 42,101.5 39,104.5 39,107.5 IC1.19 | v107,101.5 107.75,102.25 214.5,102.25 v214.5,96.5 208,90 v208,75 | v246.5,78 246.5,89 v239,96.5
  Route7 2: v88.5,76 88.5,82.52 86.68,84.33 86.68,86.67 89.61,89.59 95.79,89.59 101.6,95.4 101.6,99.75 103.15,101.31 106.81,101.31 v107,101.5
  Bottom 2: 89,74.5 86.5,72 D75.A | 89,74.5 100.5,74.5 103,72 105.5,72 D74.A | D78.A 29.5,72 32,74.5 42.5,74.5 45.5,71.5 47.5,71.5 D77.A 48,72 50.5,74.5 62,74.5 65,71.5 66.5,71.5 D76.A 67,72 71,76 v82,76 | v88.5,76 88.5,75 89,74.5 | D105.A 266,71 266,66.5 262,62.5 251,62.5 247.5,66 247.5,71 D106.A 246.5,72 v246.5,78 | 207.5,74.5 193.5,74.5 191,72 D109.A | 207.5,74.5 210,72 D108.A 210.5,72.5 212.5,74.5 223,74.5 226,71.5 228,71.5 D107.A | v107,101.5 v53.5,101.5 | v208,75 207.5,74.5 | v214.5,96.5 v239,96.5
ROW3  (via drill 2)  (1 unrouted)
  Top 2: v46.5,57 v40.5,57 | v86.5,56 86.5,68.5 82.5,72.5 81.5,72.5 76,78 55,78 48.5,84.5 48.5,87.5 36.5,99.5 36.5,107.5 IC1.18
  Bottom 2: D118.A 191,53 193.5,55.5 204.5,55.5 207.5,52.5 209,52.5 D121.A 209.5,53 212,55.5 225,55.5 227.5,53 D122.A 228.5,52.5 231.5,55.5 244,55.5 247,52.5 D123.A 247.5,53 250,55.5 261,55.5 264,52.5 266,52.5 D124.A | 49.5,54 51,55.5 63.5,55.5 66.5,52.5 D91.A 67,53 69.5,55.5 86,55.5 v86.5,56 88,54.5 | 49.5,54 48,52.5 D89.A | v40.5,57 38,59.5 32.5,59.5 30,57 D88.A | 49.5,54 v46.5,57 | 88,54.5 89,55.5 101.5,55.5 104.5,52.5 D95.A | 88,54.5 86,52.5 D92.A
ROW4  (via drill 2)
  Top 2: v223.5,38 v213.5,38 | 63,38 v43,38 | v64.5,36.5 63,38 | v39,81 48.5,81 55,74.5 61.5,74.5 63.5,72.5 | 63.5,72.5 65.5,70.5 65.5,40.5 | 63,38 65.5,40.5 | v87.5,38 68,38 65.5,40.5 | v193,38 193,44.5 189,48.5 189,70.5 177,82.5 174,82.5 170.5,86 170.5,96 169.5,97 141.5,97 141.5,81.75 140.75,81 135.25,81 129.5,75.25 107.75,75.25 102,81 v75,81 | 63.5,72.5 v66,75
  Bottom 2: 193.5,36.5 190.5,33.5 D119.A | 193.5,36.5 206,36.5 209,33.5 D120.A 209.5,34 v213.5,38 | D125.A 256.5,33.5 252.5,37.5 232.5,37.5 228.5,33.5 D126.A 227.5,34 v223.5,38 | 89.5,36 90,36.5 102.5,36.5 105.5,33.5 D94.A | 89.5,36 87,33.5 D93.A | v43,38 38.5,33.5 D87.A | v64.5,36.5 67,34 D90.A | v39,81 33,81 27,87 27,93 31,97 31,107.5 IC1.16 | v87.5,38 89.5,36 | v193,38 193,37 193.5,36.5 | v75,81 72,81 v66,75
ROW5  (via drill 2)  (1 unrouted)
  Top 2: v32,22.5 32,32.2 | 32,32.2 v32,38 | v66,21 66,25.5 57,34.5 51,34.5 48.7,32.2 32,32.2
  Bottom 2: D129.A 181,14 181,9 184.5,5.5 200.5,5.5 209,14 D111.A 209.5,15 216.5,22 219,22 226.5,14.5 228,14.5 D112.A 228.5,13.5 228.5,9 232,5.5 243,5.5 247,9.5 | 247,9.5 247,14 D113.A | 247,9.5 251,5.5 262,5.5 266,9.5 266,14 D114.A | 85.5,9.5 81.5,5.5 70.5,5.5 67,9 67,14 D85.A 66,15 v66,21 | 85.5,9.5 85.5,14 D86.A | D130.A 108,13 100.5,5.5 89.5,5.5 85.5,9.5 | 32.5,17.5 43.5,17.5 46.5,14.5 47.5,14.5 D84.A | 32.5,17.5 30,15 D83.A | v32,38 32,42.5 24.5,50 24.5,94 28.5,98 28.5,107.5 IC1.15 | v32,22.5 32,18 32.5,17.5
ROW6  (via drill 2)
  Top 2: v15,95 16,95 20.5,90.5 v20.5,90 20.5,83 v19,81.5 18.5,81 18.5,66 15.5,63 15.5,54.5 19,51 v19,43.5 | v45,97.75 56.25,97.75 v56.5,97.5 | v290.5,91.5 289.5,91.5 273.65,107.35 259.4,107.35 257.75,109 v140.25,109
  Route7 2: v140.25,109 129.9,98.65 113.5,98.65 110.8,95.95 108.6,95.95 105.9,98.65 v104.25,98.65
  Bottom 2: D104.A 295.5,15.5 295.5,34.5 D127.A 295.5,35.5 295.5,62.5 D128.A 295.5,63.5 295.5,91 D115.A 291,91 v290.5,91.5 | 19,38.5 5.5,38.5 4.5,37.5 D81.A | 19,38.5 20,38.5 22,36.5 22,31.5 9,18.5 4.5,18.5 D82.A | 14.5,77 12.5,79 8,79 4.5,75.5 D79.A | 14.5,77 18,73.5 18,65.5 9,56.5 4.5,56.5 D80.A | v15,95 14.5,94.5 4.5,94.5 D45.A | 14.5,77 v19,81.5 | v20.5,90 20.5,103 27.5,110 32.5,110 33.5,109 33.5,108 IC1.17 34.24,107.27 34.24,106.99 43.48,97.75 v45,97.75 | v19,43.5 19,38.5 | v56.5,97.5 103.1,97.5 v104.25,98.65
ROW7  (via drill 2)
  Top 2: v128.5,38 133,38 141.5,46.5 141.5,51.5 v136,57 136.5,57.5 136.5,60.5 141.5,65.5 141.5,71 v136.5,76 | IC1.24 51.5,107.5 63,96 101.1,96 105.68,91.42 105.68,84.11 109.71,80.08 122.4,80.08 122.4,93.6 v121,95
  Bottom 2: D98.A 172,34 172,53 D110.A 172,54 172,72 D117.A 172,73 172,91 D116.A 171.5,91.5 171.5,95 170,96.5 141.5,96.5 138.5,93.5 | v128.5,38 125,34.5 125,33.5 D97.A | v136,57 130.5,57 125,51.5 D96.A | 133,79.5 136,82.5 139.5,82.5 141.5,84.5 141.5,90.5 138.5,93.5 | 133,79.5 125,71.5 D73.A | 138.5,93.5 134,98 132,98 125,91 D72.A 124.5,91.5 v121,95 | 133,79.5 v136.5,76
VCC  (via drill 1)
  Top 0.406: U1.VBUS1 105.8,119.83 106.88,118.75
  Top 1.27: 109.25,118.75 v111.62,118.75 114,121.12 114,123.5 123.5,123.5 C7.1 C6.1 C5.1 C4.1 C3.1 | 109.25,118.75 106.88,118.75 | IC1.20 41.31,105.34 v41.56,105.09 43.85,107.39 IC1.21 | R5.1 109.25,114 | 109.25,114 R2.1 | 109.25,114 109.25,118.75
  Route7 0.076: v41.56,105.09 64.12,104.5 arc60 v111.62,118.75
  Bottom 1.27: IC1.7 46.4,112.89 45.12,111.62 | IC1.21 43.85,110.36 45.12,111.62 | IC1.20 41.31,110.19 42.75,111.62 45.12,111.62
(copper drawn outside any net)
  shapes: Top area x4